# Altium schematic sheet 0_COVER.SchDoc: SmartHalo V1.0 Rev1 - Cover
size B; Author: Sébastien Gélinas; Organization: CycleLabs Solutions Inc.; Address1: 5445 de Gaspé; Address2: Montréal, QC; Address3: Canada; Address4: H2T 3B2; DocumentNumber: 1; Revision: 1; SheetNumber: 0; SheetTotal: 8
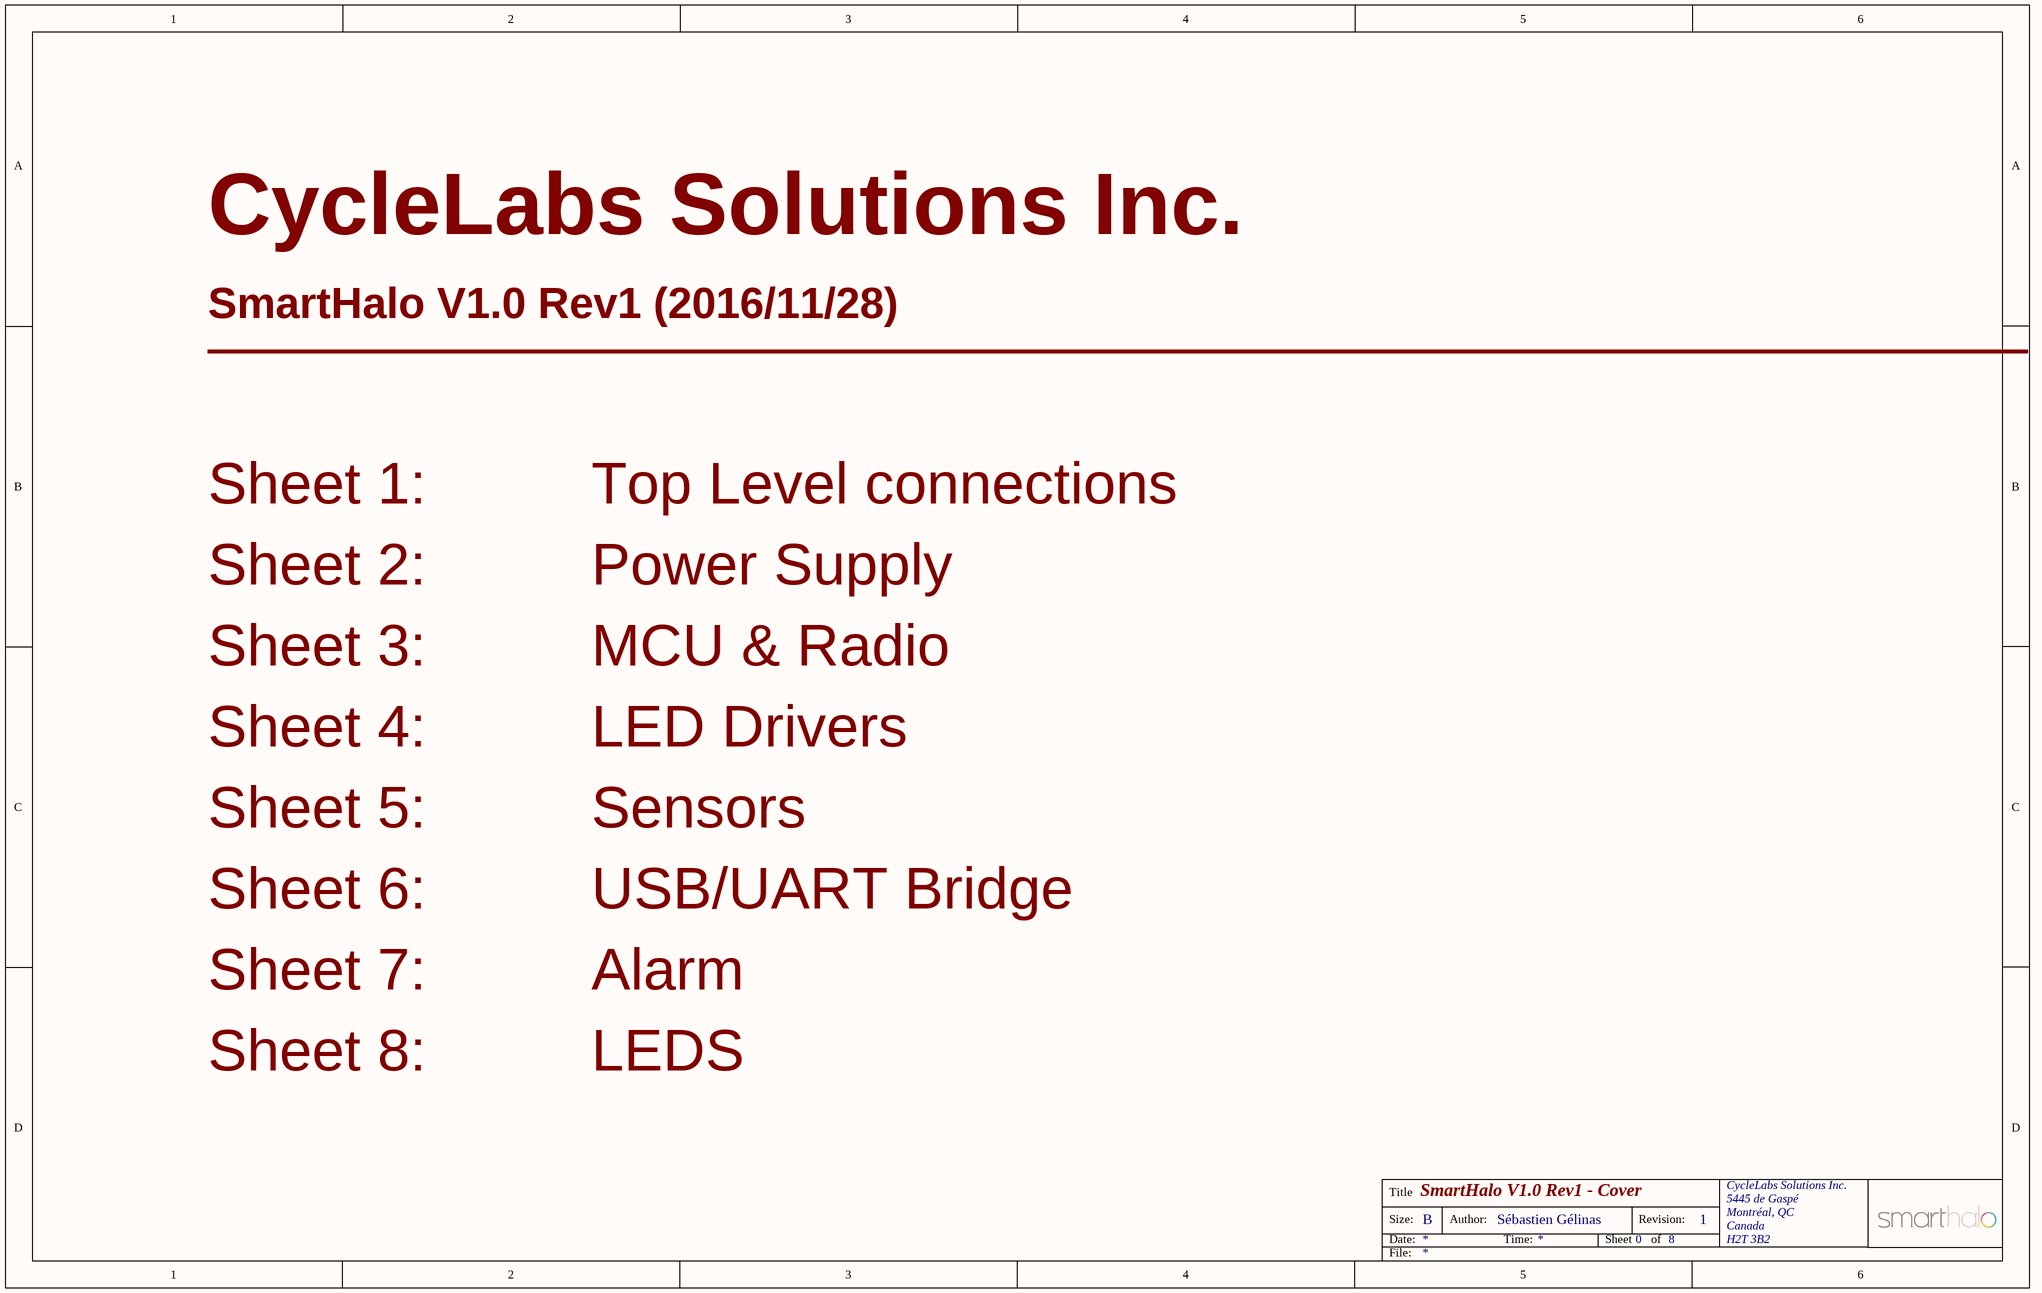
[diagram p0: 0_COVER.SchDoc]

## Notes on the sheet
- CycleLabs Solutions Inc.
- SmartHalo V1.0 Rev1 (2016/11/28)
- ________________________________________________________
- Sheet 1:          Top Level connections
- Sheet 2:          Power Supply
- Sheet 3:          MCU & Radio
- Sheet 4:          LED Drivers
- Sheet 5:          Sensors
- Sheet 6:          USB/UART Bridge
- Sheet 7:          Alarm
- Sheet 8:          LEDS
- Title
- Size:
- Date:
- B
- Author:
- Time:
- Sheet
- Revision:
- of
- File: